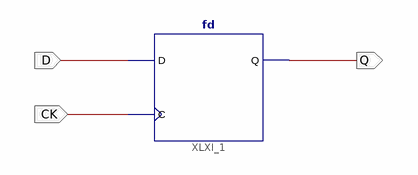
[diagram p0: schematic sheet 1]
// Xilinx ISE schematic fd1.sch (virtex4) as structural Verilog: 1 symbols, 3 ports
module fd1 (
  input  D,
  input  CK,
  output Q
);

  fd XLXI_1 (.C(CK), .D(D), .Q(Q));
endmodule
